# Altium schematic sheet power_supply.SchDoc
size A4; SheetNumber: 4; SheetTotal: 4
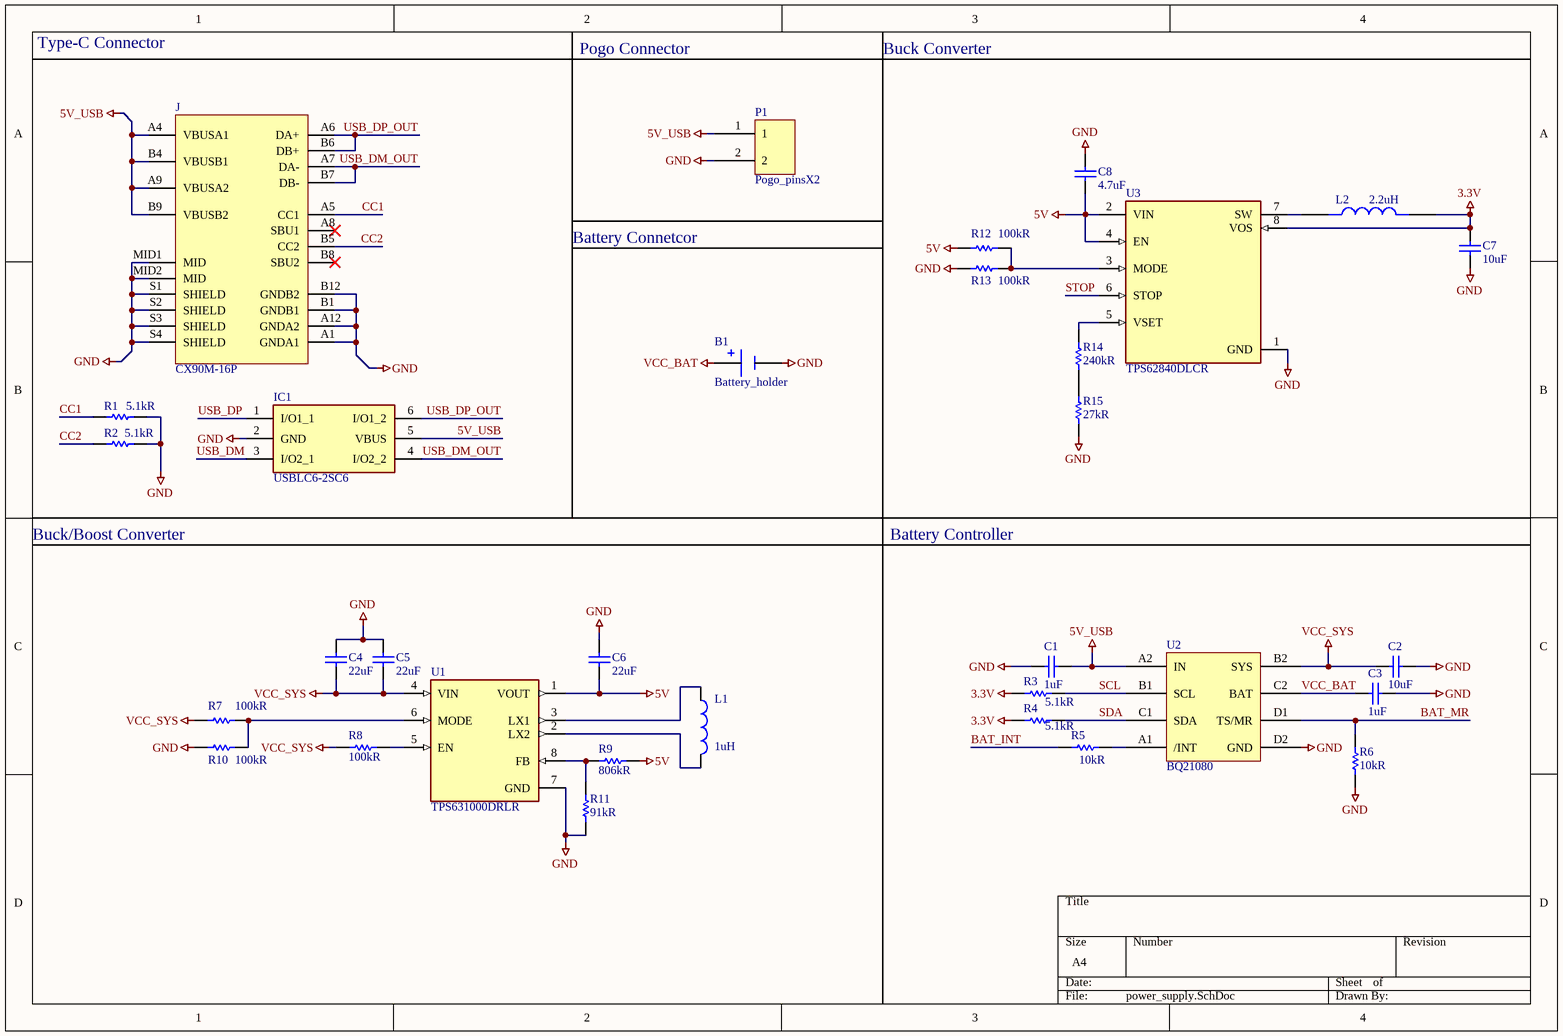
[diagram p0: power_supply.SchDoc]

## Parts
B1  Battery_holder  [battery connection]
C1  1uF  [CAP_0402]
C2  10uF  [CAP_0402]
C3  1uF  [CAP_0402]
C4  22uF  [CAP_0402]
C5  22uF  [CAP_0402]
C6  22uF  [CAP_0402]
C7  10uF  [CAP_0402]
C8  4.7uF  [CAP_0402]
IC1  USBLC6-2SC6  [SOT95P280X145-6N]
J  CX90M-16P  [HRS_CX90M-16P]
L1  1uH  [INDC1608X100N]
L2  2.2uH  [INDC2012X100N]
P1  Pogo_pinsX2  [pogo_2_pins_amgled]
R1  5.1kR  [RES_0402]
R2  5.1kR  [RES_0402]
R3  5.1kR  [RES_0402]
R4  5.1kR  [RES_0402]
R5  10kR  [RES_0402]
R6  10kR  [RES_0402]
R7  100kR  [RES_0402]
R8  100kR  [RES_0402]
R9  806kR  [RES_0402]
R10  100kR  [RES_0402]
R11  91kR  [RES_0402]
R12  100kR  [RES_0402]
R13  100kR  [RES_0402]
R14  240kR  [RES_0402]
R15  27kR  [RES_0402]
U1  TPS631000DRLR  [SOT50P160X60-8N]
U2  BQ21080  [IC_BQ25180YBGR]
U3  TPS62840DLCR  [SON50P200X150X100-8N]

## Nets
3.3V: C7.2 L2.2 R3.2 R4.2 U3.8(VOS)
5V: C6.1 C8.2 R9.1 R12.1 U1.1(VOUT) U3.2(VIN) U3.4(EN)
5V_USB: C1.2 IC1.5(VBUS) J.A4(VBUSA1) J.A9(VBUSA2) J.B4(VBUSB1) J.B9(VBUSB2) P1.1 U2.A2(IN)
GND: B1.2(NEG) C1.1 C2.1 C3.1 C4.2 C5.2 C6.2 C7.1 C8.1 IC1.2(GND) J.A1(GNDA1) J.A12(GNDA2) J.B1(GNDB1) J.B12(GNDB2) J.MID1(MID) J.MID2(MID) J.S1(SHIELD) J.S2(SHIELD) J.S3(SHIELD) J.S4(SHIELD) P1.2 R1.2 R2.2 R6.2 R10.1 R11.1 R13.1 R15.1 U1.7(GND) U2.D2(GND) U3.1(GND)
VCC_BAT: B1.1(POS) C3.2 U2.C2(BAT)
VCC_SYS: C2.2 C4.1 C5.1 R7.1 R8.1 U1.4(VIN) U2.B2(SYS)
BAT_INT: R5.2
BAT_MR: R6.1 U2.D1(TS/MR)
CC1: J.A5(CC1) R1.1
CC2: J.B5(CC2) R2.1
SCL: R3.1 U2.B1(SCL)
SDA: R4.1 U2.C1(SDA)
STOP: U3.6(STOP)
USB_DM: IC1.3(I/O2_1)
USB_DM_OUT: IC1.4(I/O2_2) J.A7(DA-) J.B7(DB-)
USB_DP: IC1.1(I/O1_1)
USB_DP_OUT: IC1.6(I/O1_2) J.A6(DA+) J.B6(DB+)
NetL1_1: L1.1 U1.3(LX1)
NetL1_2: L1.2 U1.2(LX2)
NetL2_1: L2.1 U3.7(SW)
NetR5_1: R5.1 U2.A1(/INT)
NetR7_2: R7.2 R10.2 U1.6(MODE)
NetR8_2: R8.2 U1.5(EN)
NetR9_2: R9.2 R11.2 U1.8(FB)
NetR12_2: R12.2 R13.2 U3.3(MODE)
NetR14_1: R14.1 U3.5(VSET)
NetR14_2: R14.2 R15.2

Not connected (* = marked no-connect by the designer): J A8(SBU1)* B8(SBU2)*

## Notes on the sheet
- Type-C Connector
- Pogo Connector
- Buck Converter
- Battery Connetcor
- Buck/Boost Converter
- Battery Controller

## Library data of the parts
B1 = Battery_holder: li-ion 14500 battery holder; BOM_GROUP: Power Connectors
C1 C3 = Cap_1uF_0402: MF: Murata; MP: GRM022R60J222KE19L; BOM_GROUP: Battery managment; SnapEDA_Link: https://www.snapeda.com/parts/GRM022R60J222KE19L/Murata/view-part/?ref=snap; Package: 0402 Murata; Value: *; Check_prices: https://www.snapeda.com/parts/GRM022R60J222KE19L/Murata/view-part/?ref=eda
C2 = Cap_10uF_0402: MF: Murata; MP: GRM022R60J222KE19L; BOM_GROUP: Battery managment; SnapEDA_Link: https://www.snapeda.com/parts/GRM022R60J222KE19L/Murata/view-part/?ref=snap; Package: 0402 Murata; Value: *; Check_prices: https://www.snapeda.com/parts/GRM022R60J222KE19L/Murata/view-part/?ref=eda
C4-C6 = Cap_22uF_0402: MF: Murata; MP: GRM022R60J222KE19L; BOM_Group: Buck/Boost Converter to 5V; SnapEDA_Link: https://www.snapeda.com/parts/GRM022R60J222KE19L/Murata/view-part/?ref=snap; Package: 0402 Murata; Value: *; Check_prices: https://www.snapeda.com/parts/GRM022R60J222KE19L/Murata/view-part/?ref=eda
C7 = Cap_10uF_0402: MF: Murata; MP: GRM022R60J222KE19L; BOM_Group: Buck 3.3V Converter; SnapEDA_Link: https://www.snapeda.com/parts/GRM022R60J222KE19L/Murata/view-part/?ref=snap; Package: 0402 Murata; Value: *
C8 = Cap_4.7uF_0402: MF: Murata; MP: GRM022R60J222KE19L; BOM_Group: Buck 3.3V Converter; SnapEDA_Link: https://www.snapeda.com/parts/GRM022R60J222KE19L/Murata/view-part/?ref=snap; Package: 0402 Murata; Value: *
IC1 = USBLC6-2SC6: Integrated Circuit; Manufacturer_Name: STMicroelectronics; BOM_GROUP: Type-c; Datasheet Link: http://www.st.com/st-web-ui/static/active/en/resource/technical/document/datasheet/CD00050750.pdf; Height: 1.45mm; Manufacturer_Part_Number: USBLC6-2SC6; Mouser Part Number: 511-USBLC6-2SC6; Mouser Price/Stock: https://www.mouser.co.uk/ProductDetail/STMicroelectronics/USBLC6-2SC6?qs=po45yt2pPpu%2FhNIlwQdTlg%3D%3D; Arrow Part Number: USBLC6-2SC6; Arrow Price/Stock: https://www.arrow.com/en/products/usblc6-2sc6/stmicroelectronics?utm_currency=USD&region=europe
J = CX90M-16P: USB-C _USB TYPE-C_ USB 3.1 _USB 3.1 Gen 2, Superspeed+_ Receptacle Connector 24 _16+8 Dummy_ Position Board Edge, Cutout; Surface Mount; Through Hole, Right Angle; MF: Hirose Electric Co Ltd; BOM_GROUP: Type-c; MP: CX90M-16P; Price: None; Package: None; Availability: Unavailable; SnapEDA_Link: https://www.snapeda.com/parts/CX90M-16P/Hirose%20Electric%20Co%20Ltd/view-part/3218310/?ref=snap; Value: *
L1 = DFE18SAN1R0MG0L: BOM_Group: Buck/Boost Converter to 5V; Package: None; Price: None; Value: *; MP: DFE18SAN1R0MG0L; Availability: Unavailable
L2 = MLP2012S2R2MT0S1: 2.2 ÂµH Shielded Multilayer Inductor 800 mA 299mOhm Max 0805 (2012 Metric); MF: TDK; BOM_Group: Buck 3.3V Converter; SnapEDA_Link: https://www.snapeda.com/parts/MLP2012S2R2MT0S1/TDK/view-part/?ref=snap; Package: 2012 TDK; Value: *; MP: MLP2012S2R2MT0S1
P1 = Pogo_pinsX2: BOM_GROUP: Power Connectors
R1 R2 = Res_5.1kR_0402: Resistans: 1kR; BOM_GROUP: Type-c; Package: 0402
R3 R4 = Res_5.1kR_0402: Resistans: 1kR; BOM_GROUP: Battery managment; Package: 0402
R5 R6 = Res_10kR_0402: Resistans: 1kR; BOM_GROUP: Battery managment; Package: 0402
R7 R8 R10 = Res_100kR_0402_1: Resistans: 1kR; BOM_Group: Buck/Boost Converter to 5V; Package: 0402
R9 = Res_806kR_0402_1: Resistans: 1kR; BOM_Group: Buck/Boost Converter to 5V; Package: 0402
R11 = Res_91kR_0402: Resistans: 1kR; BOM_Group: Buck/Boost Converter to 5V; Package: 0402
R12 R13 = Res_100kR_0402_1: Resistans: 1kR; BOM_Group: Buck 3.3V Converter; Package: 0402
R14 = Res_240kR_0402: Resistans: 1kR; BOM_Group: Buck 3.3V Converter; Package: 0402
R15 = Res_27kR_0402: Resistans: 1kR; BOM_Group: Buck 3.3V Converter; Package: 0402
U1 = TPS631000DRLR: 1.5-A output current, high-power-density buck-boost converter; MF: Texas Instruments; BOM_Group: Buck/Boost Converter to 5V; SnapEDA_Link: https://www.snapeda.com/parts/TPS631000DRLR/Texas+Instruments/view-part/?ref=snap; Package: SOT-583 Texas Instruments; Value: *; MP: TPS631000DRLR; Check_prices: https://www.snapeda.com/parts/TPS631000DRLR/Texas+Instruments/view-part/?ref=eda
U2 = BQ21080: Battery Managment IC; BOM_GROUP: Battery managment
U3 = TPS62840DLCR: None <a href="https://snapeda.com/parts/TPS62840DLCR/Texas%20Instruments/view-part/?ref=eda">Check prices</a>; BOM_Group: Buck 3.3V Converter; Price: None; MP: TPS62840DLCR; Availability: Unavailable; Package: None; Value: *